# Altium project PCB_Project.PrjPcb
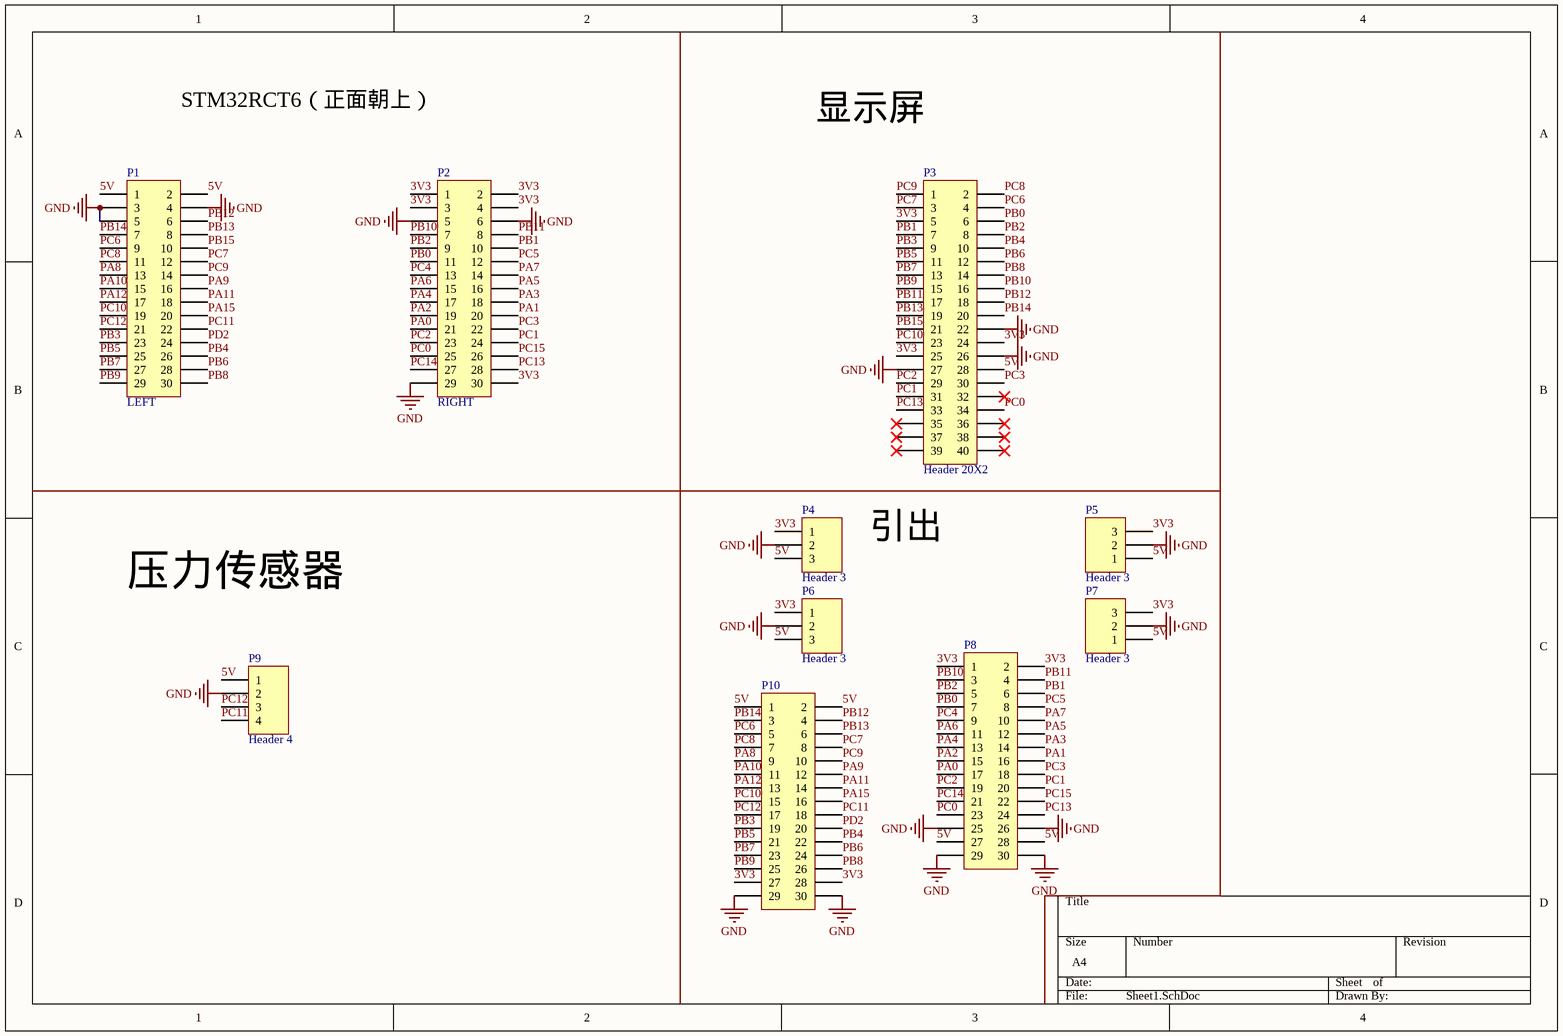
[diagram p0: Sheet1.SchDoc]
1 sheet, 10 parts. Net scope: global (net labels, ports and power ports of the same name join across sheets).
Board file: PCB1.PcbDoc

## Sheet Sheet1.SchDoc
size A4; SheetNumber: 1; SheetTotal: 1

### Parts
P1  LEFT  [IDE15X2_2.54]
P2  RIGHT  [IDE15X2_2.54]
P3  Header 20X2  [HDR2X20]
P4  Header 3  [HDR1X3]
P5  Header 3  [HDR1X3]
P6  Header 3  [HDR1X3]
P7  Header 3  [HDR1X3]
P8  (no value)  [IDE15X2_2.54]
P9  Header 4  [HDR1X4]
P10  (no value)  [IDE15X2_2.54]

### Nets
GND: P1.3 P1.4 P1.5 P2.5 P2.6 P2.29 P3.22 P3.26 P3.27 P4.2 P5.2 P6.2 P7.2 P8.25 P8.26 P8.29 P8.30 P9.2 P10.29 P10.30
3V3: P2.1 P2.2 P2.3 P2.4 P2.30 P3.5 P3.24 P3.25 P4.1 P5.3 P6.1 P7.3 P8.1 P8.2 P10.27 P10.28
5V: P1.1 P1.2 P3.28 P4.3 P5.1 P6.3 P7.1 P8.27 P8.28 P9.1 P10.1 P10.2
PA0: P2.21 P8.17
PA1: P2.20 P8.16
PA2: P2.19 P8.15
PA3: P2.18 P8.14
PA4: P2.17 P8.13
PA5: P2.16 P8.12
PA6: P2.15 P8.11
PA7: P2.14 P8.10
PA8: P1.13 P10.9
PA9: P1.16 P10.12
PA10: P1.15 P10.11
PA11: P1.18 P10.14
PA12: P1.17 P10.13
PA15: P1.20 P10.16
PB0: P2.11 P3.6 P8.7
PB1: P2.10 P3.7 P8.6
PB2: P2.9 P3.8 P8.5
PB3: P1.23 P3.9 P10.19
PB4: P1.26 P3.10 P10.22
PB5: P1.25 P3.11 P10.21
PB6: P1.28 P3.12 P10.24
PB7: P1.27 P3.13 P10.23
PB8: P1.30 P3.14 P10.26
PB9: P1.29 P3.15 P10.25
PB10: P2.7 P3.16 P8.3
PB11: P2.8 P3.17 P8.4
PB12: P1.6 P3.18 P10.4
PB13: P1.8 P3.19 P10.6
PB14: P1.7 P3.20 P10.3
PB15: P1.10 P3.21
PC0: P2.25 P3.34 P8.23
PC1: P2.24 P3.31 P8.20
PC2: P2.23 P3.29 P8.19
PC3: P2.22 P3.30 P8.18
PC4: P2.13 P8.9
PC5: P2.12 P8.8
PC6: P1.9 P3.4 P10.5
PC7: P1.12 P3.3 P10.8
PC8: P1.11 P3.2 P10.7
PC9: P1.14 P3.1 P10.10
PC10: P1.19 P3.23 P10.15
PC11: P1.22 P9.4 P10.18
PC12: P1.21 P9.3 P10.17
PC13: P2.28 P3.33 P8.24
PC14: P2.27 P8.21
PC15: P2.26 P8.22
PD2: P1.24 P10.20

Not connected (* = marked no-connect by the designer): P3 32* 35* 36* 37* 38* 39* 40*

### Notes on the sheet
- STM32RCT6（正面朝上）
- 显示屏
- 引出
- 压力传感器

### Library data of the parts
P1 P2 P8 P10 = Header 15X2: Header, 15-Pin, Dual row; LatestRevisionDate: 17-Jul-2002; LatestRevisionNote: Re-released for DXP Platform.; Publisher: Altium Limited
P3 = Header 20X2: Header, 20-Pin, Dual row; LatestRevisionDate: 17-Jul-2002; LatestRevisionNote: Re-released for DXP Platform.; Publisher: Altium Limited
P4-P7 = Header 3: Header, 3-Pin; LatestRevisionDate: 17-Jul-2002; LatestRevisionNote: Re-released for DXP Platform.; Publisher: Altium Limited
P9 = Header 4: Header, 4-Pin; LatestRevisionDate: 17-Jul-2002; LatestRevisionNote: Re-released for DXP Platform.; Publisher: Altium Limited